# EAGLE design IoTDnD (EAGLE 9.3.0)
COMPANY: ADAFRUIT INDUSTRIES; DRAWN: KTOWN; REV: B
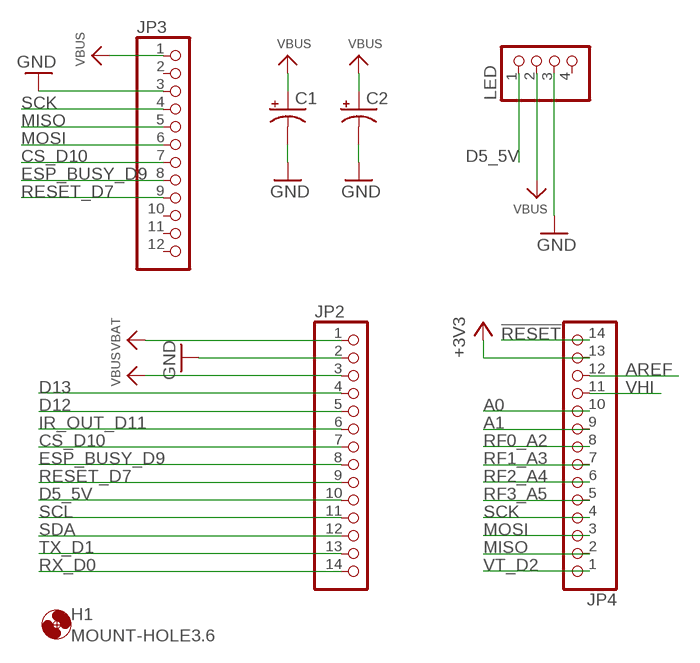
[diagram p0: schematic, sheet 1]

## Parts
C1  CPOL-USE2.5-6  [E2,5-6]
C2  CPOL-USE2.5-6  [E2,5-6]
H1  MOUNT-HOLE3.6  [3,6]
JP2  HEADER-1X14  [1X14_ROUND70]
JP3  HEADER-1X12  [1X12_ROUND]
JP4  HEADER-1X14  [1X14_ROUND70]
LED  PINHD-1X4  [1X04]

## Nets
!RESET: JP4.14
+3V3: JP4.13
A0: JP4.10
A1: JP4.9
AREF: JP4.12
CS_D10: JP2.7 JP3.7
D5_5V: JP2.10 LED.1
D12: JP2.5
D13: JP2.4
ESP_BUSY_D9: JP2.8 JP3.8
GND: C1.- C2.- JP2.2 JP3.3 LED.3
IR_OUT_D11: JP2.6
MISO: JP3.5 JP4.2
MOSI: JP3.6 JP4.3
RESET_D7: JP2.9 JP3.9
RF0_A2: JP4.8
RF1_A3: JP4.7
RF2_A4: JP4.6
RF3_A5: JP4.5
RX_D0: JP2.14
SCK: JP3.4 JP4.4
SCL: JP2.11
SDA: JP2.12
TX_D1: JP2.13
VBAT: JP2.1
VBUS: C1.+ C2.+ JP2.3 JP3.1 LED.2
VHI: JP4.11
VT_D2: JP4.1
Unconnected: JP3.2 JP3.10 JP3.11 JP3.12 LED.4

## Library data of the parts
C1 C2 = adafruit:CPOL-US: POLARIZED CAPACITOR, American symbol
H1 = holes-mod:MOUNT-HOLE: MOUNTING HOLE with drill center marker
JP2 JP4 = microbuilder:HEADER-1X14
JP3 = microbuilder:HEADER-1X12
LED = pinhead:PINHD-1X4: PIN HEADER

## Board
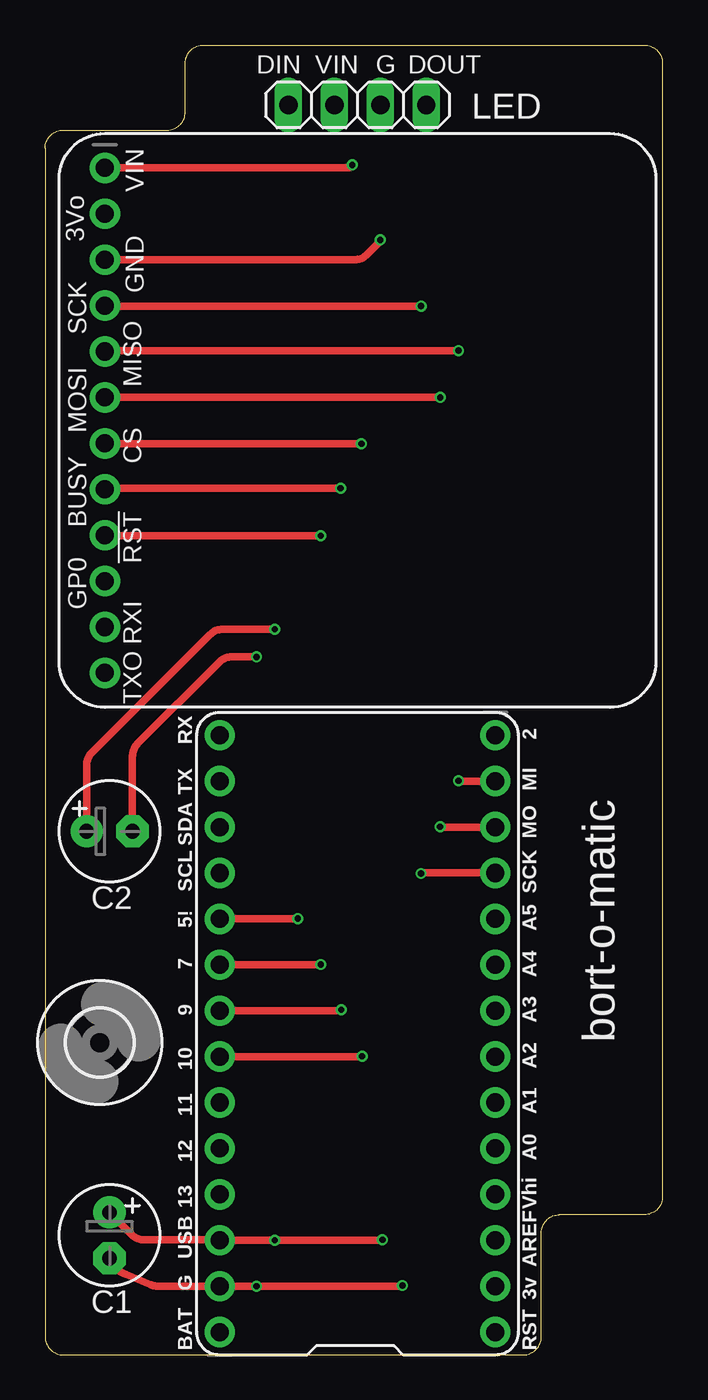
[diagram p1: board, top side]
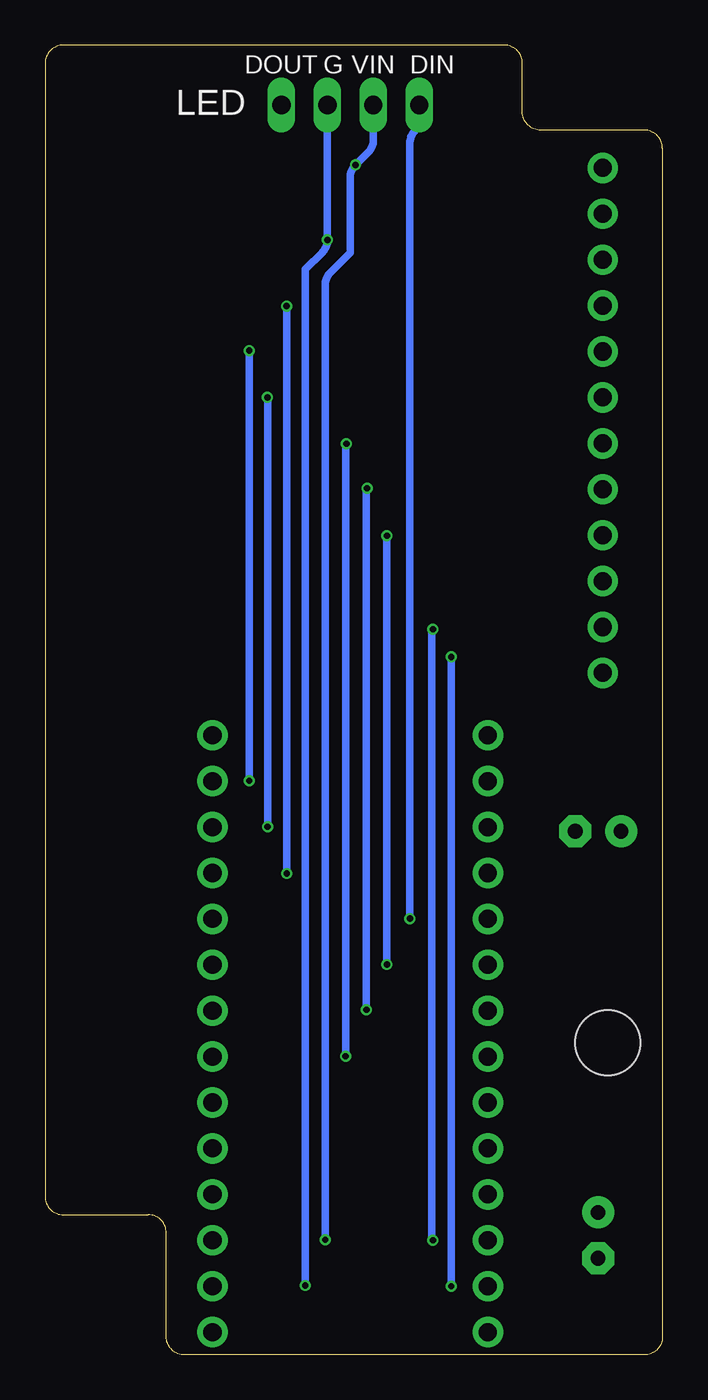
[diagram p2: board, bottom side, seen from below]

Size 34.15 x 72.45 mm. Coordinates in mm from the lower left corner, seen from the top.
Outline: 0,66.75 0,1 arc90 1,0 26.45,0 arc90 27.45,1 27.45,6.75 arc-90 28.45,7.75 33.15,7.75 arc90 34.15,8.75 34.15,71.45 arc90 33.15,72.45 8.75,72.45 arc90 7.75,71.45 7.75,68.75 arc-90 6.75,67.75 1,67.75 arc90 0,66.75
Copper layers (1*16): Top 0.035559375mm / dielectric 1.6mm / Bottom 0.035559375mm
Design rules "oshpark-2layer *": minimum track width 6mil, minimum drill 10mil, track to track 6mil, track to pad 6mil, pad to pad 6mil, via to via 6mil, smd to smd 6mil, copper to edge 15mil, drill to drill 6mil, minimum pad ring 5mil, minimum via ring 5mil, stop-mask expansion 2.5mil, vias tented up to drill 16mil, thermal gap 10mil

### Footprints (pad centres in the part's own frame; a part is rotated, then mirrored left to right if it is on the bottom)
E2,5-6 = drill 0.813 pad 1.778: + -1.27,0 | drill 0.813 pad 1.778 octagon: - 1.27,0
3,6 = hole 3.6: 0,0
1X14_ROUND70 = drill 1 pad 1.676: 1 -16.51,0; 2 -13.97,0; 3 -11.43,0; 4 -8.89,0; 5 -6.35,0; 6 -3.81,0; 7 -1.27,0; 8 1.27,0; 9 3.81,0; 10 6.35,0; 11 8.89,0; 12 11.43,0; 13 13.97,0; 14 16.51,0
1X12_ROUND = drill 1 pad 1.676: 1 -13.97,0; 2 -11.43,0; 3 -8.89,0; 4 -6.35,0; 5 -3.81,0; 6 -1.27,0; 7 1.27,0; 8 3.81,0; 9 6.35,0; 10 8.89,0; 11 11.43,0; 12 13.97,0
1X04 = drill 1.016 long: 1 -3.81,0; 2 -1.27,0; 3 1.27,0; 4 3.81,0

### Placement (x,y rotation side)
C1  3.56,6.61 270 top
C2  3.56,28.96 0 top
H1  3.02,17.27 0 top
JP2  9.66,17.77 90 top
JP3  3.31,51.69 270 top
JP4  24.9,17.77 270 top
LED  17.27,69.15 0 top
U$4  [ITSYM4_TOP]  26.17,-0.01 90 top
U$5  [ITSYM4_BOT]  26.17,35.55 270 bottom

### Tracks (layer width: path | path; a pad name or v marks a point on that pad's centre or on a via)
CS_D10  (via drill 0.35)
  Top 0.406: JP2.7 17.49,16.5 arc45 v17.53,16.51 | v17.49,50.4 3.35,50.4 arc-45 JP3.7
  Bottom 0.406: v17.53,16.51 17.53,50.22 arc-45 17.61,50.4 v17.49,50.4
D5_5V  (via drill 0.35)
  Top 0.406: JP2.10 13.93,24.12 arc45 v13.97,24.13
  Bottom 0.406: LED.1 arc45 13.29,68.73 13.29,68.13 13.68,67.74 arc-45 13.97,67.03 v13.97,24.13
ESP_BUSY_D9  (via drill 0.35)
  Top 0.406: JP2.8 16.24,19.04 arc-45 v16.38,19.09 | v16.34,47.94 3.44,47.94 arc45 JP3.8
  Bottom 0.406: v16.38,19.09 16.38,47.85 arc45 16.36,47.9 16.36,47.91 arc-45 v16.34,47.94
GND  (via drill 0.35)
  Top 0.406: JP3.3 17.12,60.58 arc45 17.82,60.88 18.54,61.59 v18.54,61.68 | v19.76,3.83 19.77,3.83 arc-45 19.82,3.81 arc-45 19.77,3.8 v11.69,3.8 JP2.2 6.22,3.8 arc-23 5.84,3.87 4.45,4.45 arc-45 C1.- | v11.69,38.61 10.32,38.61 arc45 9.62,38.32 5.12,33.83 arc45 4.83,33.12 C2.-
  Bottom 0.406: LED.3 v18.54,61.68 arc45 18.83,60.97 19.76,60.04 v19.76,3.83 arc45 v19.76,3.83 | v11.69,3.8 v11.69,38.61
MISO  (via drill 0.35)
  Top 0.406: JP4.2 22.91,31.74 arc-45 v22.86,31.75 | v22.86,55.55 3.42,55.55 arc45 JP3.5
  Bottom 0.406: v22.86,31.75 v22.86,55.55
MOSI  (via drill 0.35)
  Top 0.406: JP4.3 21.89,29.2 arc-45 v21.85,29.21 | v21.86,52.96 JP3.6 arc45 JP3.6
  Bottom 0.406: v21.85,29.21 21.85,52.95 arc-45 v21.86,52.96
RESET_D7  (via drill 0.35)
  Top 0.406: JP2.9 15.2,21.58 arc45 v15.24,21.59 | v15.24,45.31 3.38,45.31 arc-45 JP3.9
  Bottom 0.406: v15.24,21.59 v15.24,45.31
SCK  (via drill 0.35)
  Top 0.406: JP4.4 20.86,26.66 arc-45 v20.79,26.63 | v20.79,58.02 3.37,58.02 arc-45 JP3.4
  Bottom 0.406: v20.79,26.63 v20.79,58.01 arc-45 v20.79,58.02
VBUS  (via drill 0.35)
  Top 0.406: v18.66,6.36 arc-45 18.5,6.34 v12.7,6.34 JP2.3 arc45 9.61,6.35 5.5,6.35 arc-45 4.79,6.65 C1.+ | JP3.1 16.71,65.66 arc45 17.02,65.79 v16.98,65.83 | v12.7,40.14 9.82,40.14 arc45 9.11,39.84 2.58,33.32 arc45 2.29,32.61 C2.+
  Bottom 0.406: v18.66,6.36 18.66,6.47 18.66,59.17 arc45 18.37,59.87 17.28,60.96 17.28,65.12 arc45 v16.98,65.83 16.26,66.55 arc-45 16,67.18 LED.2 | v12.7,6.34 12.7,6.35 arc45 12.76,6.49 12.76,40 arc45 v12.7,40.14

### Text on the board
tPlace: VIN | 3Vo | GND | SCK | MISO | MOSI | CS | BUSY | !RST | GP0 | RXI | TXO
tNames: DIN | VIN | G | DOUT | RX | 2 | TX | MI | bort-o-matic | MO | SDA | SCL | SCK | 5! | A5 | 7 | A4 | 9 | A3 | 10 | A2 | A1 | 11 | 12 | A0 | 13 | Vhi | USB | AREF | G | 3v | BAT | RST
bNames: DIN | VIN | G | DOUT | LED